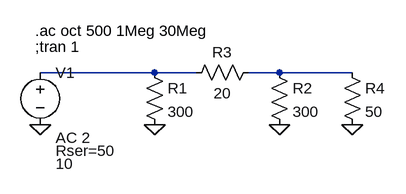
[diagram p0: schematic pi-attenuator.asc]
pi-attenuator.asc, the LTspice schematic file:
Version 4
SHEET 1 880 680
WIRE 144 144 -32 144
WIRE 208 144 144 144
WIRE 336 144 288 144
WIRE 448 144 336 144
FLAG 144 224 0
FLAG 336 224 0
FLAG 448 224 0
FLAG -32 224 0
SYMBOL res 128 128 R0
SYMATTR InstName R1
SYMATTR Value 300
SYMBOL res 320 128 R0
SYMATTR InstName R2
SYMATTR Value 300
SYMBOL res 304 128 R90
WINDOW 0 0 56 VBottom 2
WINDOW 3 32 56 VTop 2
SYMATTR InstName R3
SYMATTR Value 20
SYMBOL voltage -32 128 R0
WINDOW 3 24 156 Left 2
WINDOW 123 24 116 Left 2
WINDOW 39 24 136 Left 2
SYMATTR Value 10
SYMATTR Value2 AC 2
SYMATTR SpiceLine Rser=50
SYMATTR InstName V1
SYMBOL res 432 128 R0
SYMATTR InstName R4
SYMATTR Value 50
TEXT -40 80 Left 2 !.ac oct 500 1Meg 30Meg
TEXT -40 104 Left 2 !;tran 1

The netlist it stands for:
* pi-attenuator.asc
R1 N001 0 300
R2 N002 0 300
R3 N002 N001 20
V1 N001 0 10 AC 2 Rser=50
R4 N002 0 50
.ac oct 500 1Meg 30Meg
;tran 1
.backanno
.end